# EasyEDA schematic 1-Schematic_LP2951-xx Matrix Test Board.json
TITLE: 12 Matrix LP2951 Evaluation Board; REV: 2.0; Date: 2024-05-15; Sheet: 1/1; Drawn By: daylenfeist; Company: STARR-Lab
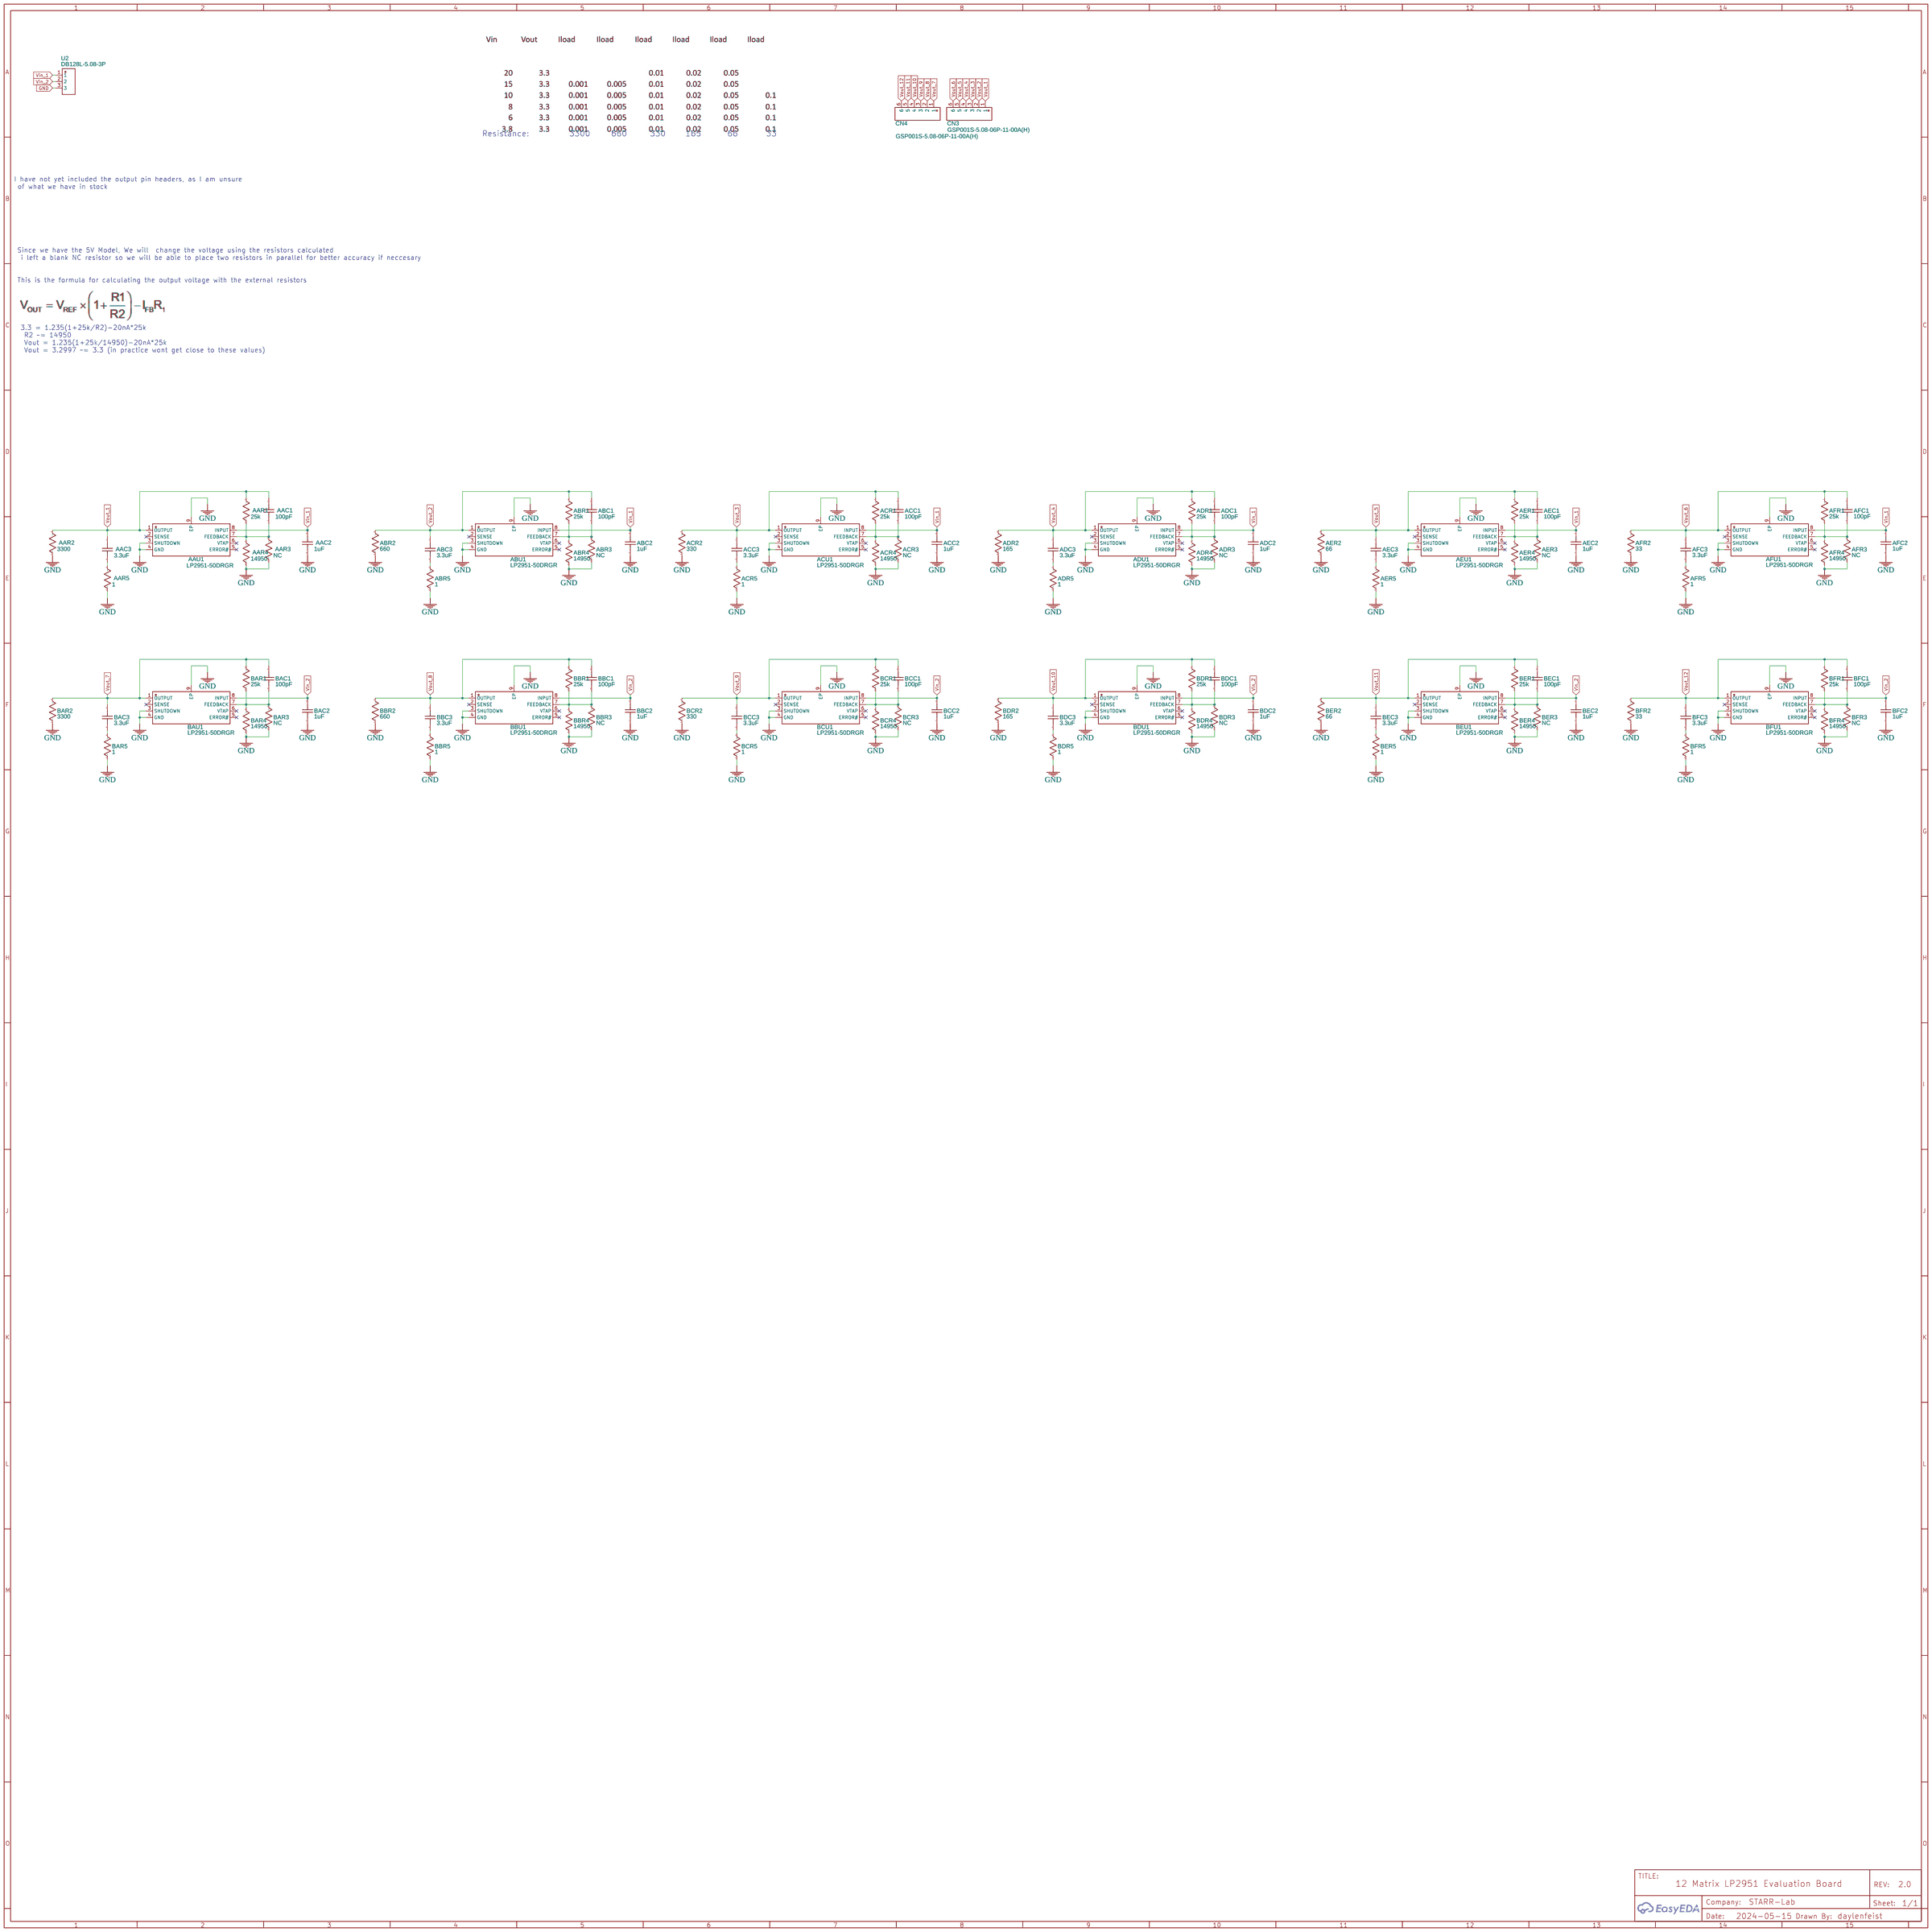
[diagram p0: schematic sheet]

## Parts
AAC1  100pF  [C0805]
AAC2  1uF  [C0805]
AAC3  3.3uF  [C0805]
AAR1  25k  [R0805]
AAR2  3300  [R0805]
AAR3  NC  [R0805]
AAR4  14950  [R0805]
AAR5  1  [R0805]
AAU1  LP2951-50DRGR  [WSON-8_L3.0-W3.0-P0.50-TL-EP]
ABC1  100pF  [C0805]
ABC2  1uF  [C0805]
ABC3  3.3uF  [C0805]
ABR1  25k  [R0805]
ABR2  660  [R0805]
ABR3  NC  [R0805]
ABR4  14950  [R0805]
ABR5  1  [R0805]
ABU1  LP2951-50DRGR  [WSON-8_L3.0-W3.0-P0.50-TL-EP]
ACC1  100pF  [C0805]
ACC2  1uF  [C0805]
ACC3  3.3uF  [C0805]
ACR1  25k  [R0805]
ACR2  330  [R0805]
ACR3  NC  [R0805]
ACR4  14950  [R0805]
ACR5  1  [R0805]
ACU1  LP2951-50DRGR  [WSON-8_L3.0-W3.0-P0.50-TL-EP]
ADC1  100pF  [C0805]
ADC2  1uF  [C0805]
ADC3  3.3uF  [C0805]
ADR1  25k  [R0805]
ADR2  165  [R0805]
ADR3  NC  [R0805]
ADR4  14950  [R0805]
ADR5  1  [R0805]
ADU1  LP2951-50DRGR  [WSON-8_L3.0-W3.0-P0.50-TL-EP]
AEC1  100pF  [C0805]
AEC2  1uF  [C0805]
AEC3  3.3uF  [C0805]
AER1  25k  [R0805]
AER2  66  [R0805]
AER3  NC  [R0805]
AER4  14950  [R0805]
AER5  1  [R0805]
AEU1  LP2951-50DRGR  [WSON-8_L3.0-W3.0-P0.50-TL-EP]
AFC1  100pF  [C0805]
AFC2  1uF  [C0805]
AFC3  3.3uF  [C0805]
AFR1  25k  [R0805]
AFR2  33  [R0805]
AFR3  NC  [R0805]
AFR4  14950  [R0805]
AFR5  1  [R0805]
AFU1  LP2951-50DRGR  [WSON-8_L3.0-W3.0-P0.50-TL-EP]
BAC1  100pF  [C0805]
BAC2  1uF  [C0805]
BAC3  3.3uF  [C0805]
BAR1  25k  [R0805]
BAR2  3300  [R0805]
BAR3  NC  [R0805]
BAR4  14950  [R0805]
BAR5  1  [R0805]
BAU1  LP2951-50DRGR  [WSON-8_L3.0-W3.0-P0.50-TL-EP]
BBC1  100pF  [C0805]
BBC2  1uF  [C0805]
BBC3  3.3uF  [C0805]
BBR1  25k  [R0805]
BBR2  660  [R0805]
BBR3  NC  [R0805]
BBR4  14950  [R0805]
BBR5  1  [R0805]
BBU1  LP2951-50DRGR  [WSON-8_L3.0-W3.0-P0.50-TL-EP]
BCC1  100pF  [C0805]
BCC2  1uF  [C0805]
BCC3  3.3uF  [C0805]
BCR1  25k  [R0805]
BCR2  330  [R0805]
BCR3  NC  [R0805]
BCR4  14950  [R0805]
BCR5  1  [R0805]
BCU1  LP2951-50DRGR  [WSON-8_L3.0-W3.0-P0.50-TL-EP]
BDC1  100pF  [C0805]
BDC2  1uF  [C0805]
BDC3  3.3uF  [C0805]
BDR1  25k  [R0805]
BDR2  165  [R0805]
BDR3  NC  [R0805]
BDR4  14950  [R0805]
BDR5  1  [R0805]
BDU1  LP2951-50DRGR  [WSON-8_L3.0-W3.0-P0.50-TL-EP]
BEC1  100pF  [C0805]
BEC2  1uF  [C0805]
BEC3  3.3uF  [C0805]
BER1  25k  [R0805]
BER2  66  [R0805]
BER3  NC  [R0805]
BER4  14950  [R0805]
BER5  1  [R0805]
BEU1  LP2951-50DRGR  [WSON-8_L3.0-W3.0-P0.50-TL-EP]
BFC1  100pF  [C0805]
BFC2  1uF  [C0805]
BFC3  3.3uF  [C0805]
BFR1  25k  [R0805]
BFR2  33  [R0805]
BFR3  NC  [R0805]
BFR4  14950  [R0805]
BFR5  1  [R0805]
BFU1  LP2951-50DRGR  [WSON-8_L3.0-W3.0-P0.50-TL-EP]
CN3  GSP001S-5.08-06P-11-00A(H)  [CONN-TH_6P-P5.08-GSP001S-5.08-06P]
CN4  GSP001S-5.08-06P-11-00A(H)  [CONN-TH_6P-P5.08-GSP001S-5.08-06P]
U2  DB128L-5.08-3P  [CONN-TH_DB128L-5.08-3P]

## Library data of the parts
AAC1-AAC3 ABC1-ABC3 ACC1-ACC3 ADC1-ADC3 AEC1-AEC3 AFC1-AFC3 BAC1-BAC3 BBC1-BBC3 BCC1-BCC3 BDC1-BDC3 BEC1-BEC3 BFC1-BFC3 = C_0603_US: Contributor: LCEDA_Lib
AAR1-AAR5 ABR1-ABR5 ACR1-ACR5 ADR1-ADR5 AER1-AER5 AFR1-AFR5 BAR1-BAR5 BBR1-BBR5 BCR1-BCR5 BDR1-BDR5 BER1-BER5 BFR1-BFR5 = R_0603_US: Contributor: LCEDA_Lib
AAU1 ABU1 ACU1 ADU1 AEU1 AFU1 BAU1 BBU1 BCU1 BDU1 BEU1 BFU1 = LP2951-50DRGR: Contributor: lcsc; Supplier: LCSC; Supplier Part: C2876162; Manufacturer: TI(德州仪器); JLCPCB Part Class: Extended Part
CN3 CN4 = GSP001S-5.08-06P-11-00A(H): Contributor: lcsc; Supplier: LCSC; Supplier Part: C5223759; Manufacturer: GOOSVN(高胜)
U2 = DB128L-5.08-3P: Contributor: LCSC; Supplier: LCSC; Supplier Part: C395869; Manufacturer: DORABO(地博电气); Manufacturer Part: DB128L-5.08-3P-GN-S; JLCPCB Part Class: Extended Part

## Nets
GND: AAC2.1 AAR2.1 AAR3.1 AAR4.1 AAR5.1 AAU1.3(SHUTDOWN) AAU1.4(GND) AAU1.9(EP) ABC2.1 ABR2.1 ABR3.1 ABR4.1 ABR5.1 ABU1.3(SHUTDOWN) ABU1.4(GND) ABU1.9(EP) ACC2.1 ACR2.1 ACR3.1 ACR4.1 ACR5.1 ACU1.3(SHUTDOWN) ACU1.4(GND) ACU1.9(EP) ADC2.1 ADR2.1 ADR3.1 ADR4.1 ADR5.1 ADU1.3(SHUTDOWN) ADU1.4(GND) ADU1.9(EP) AEC2.1 AER2.1 AER3.1 AER4.1 AER5.1 AEU1.3(SHUTDOWN) AEU1.4(GND) AEU1.9(EP) AFC2.1 AFR2.1 AFR3.1 AFR4.1 AFR5.1 AFU1.3(SHUTDOWN) AFU1.4(GND) AFU1.9(EP) BAC2.1 BAR2.1 BAR3.1 BAR4.1 BAR5.1 BAU1.3(SHUTDOWN) BAU1.4(GND) BAU1.9(EP) BBC2.1 BBR2.1 BBR3.1 BBR4.1 BBR5.1 BBU1.3(SHUTDOWN) BBU1.4(GND) BBU1.9(EP) BCC2.1 BCR2.1 BCR3.1 BCR4.1 BCR5.1 BCU1.3(SHUTDOWN) BCU1.4(GND) BCU1.9(EP) BDC2.1 BDR2.1 BDR3.1 BDR4.1 BDR5.1 BDU1.3(SHUTDOWN) BDU1.4(GND) BDU1.9(EP) BEC2.1 BER2.1 BER3.1 BER4.1 BER5.1 BEU1.3(SHUTDOWN) BEU1.4(GND) BEU1.9(EP) BFC2.1 BFR2.1 BFR3.1 BFR4.1 BFR5.1 BFU1.3(SHUTDOWN) BFU1.4(GND) BFU1.9(EP) U2.3
Vin_1: AAC2.2 AAU1.8(INPUT) ABC2.2 ABU1.8(INPUT) ACC2.2 ACU1.8(INPUT) ADC2.2 ADU1.8(INPUT) AEC2.2 AEU1.8(INPUT) AFC2.2 AFU1.8(INPUT) U2.1
Vin_2: BAC2.2 BAU1.8(INPUT) BBC2.2 BBU1.8(INPUT) BCC2.2 BCU1.8(INPUT) BDC2.2 BDU1.8(INPUT) BEC2.2 BEU1.8(INPUT) BFC2.2 BFU1.8(INPUT) U2.2
Vout_1: AAC1.1 AAC3.1 AAR1.2 AAR2.2 AAU1.1(OUTPUT) CN3.1
Vout_2: ABC1.1 ABC3.1 ABR1.2 ABR2.2 ABU1.1(OUTPUT) CN3.2
Vout_3: ACC1.1 ACC3.1 ACR1.2 ACR2.2 ACU1.1(OUTPUT) CN3.3
Vout_4: ADC1.1 ADC3.1 ADR1.2 ADR2.2 ADU1.1(OUTPUT) CN3.4
Vout_5: AEC1.1 AEC3.1 AER1.2 AER2.2 AEU1.1(OUTPUT) CN3.5
Vout_6: AFC1.1 AFC3.1 AFR1.2 AFR2.2 AFU1.1(OUTPUT) CN3.6
Vout_7: BAC1.1 BAC3.1 BAR1.2 BAR2.2 BAU1.1(OUTPUT) CN4.1
Vout_8: BBC1.1 BBC3.1 BBR1.2 BBR2.2 BBU1.1(OUTPUT) CN4.2
Vout_9: BCC1.1 BCC3.1 BCR1.2 BCR2.2 BCU1.1(OUTPUT) CN4.3
Vout_10: BDC1.1 BDC3.1 BDR1.2 BDR2.2 BDU1.1(OUTPUT) CN4.4
Vout_11: BEC1.1 BEC3.1 BER1.2 BER2.2 BEU1.1(OUTPUT) CN4.5
Vout_12: BFC1.1 BFC3.1 BFR1.2 BFR2.2 BFU1.1(OUTPUT) CN4.6
Net-(AAC1-2): AAC1.2 AAR1.1 AAR3.2 AAR4.2 AAU1.7(FEEDBACK)
Net-(AAC3-2): AAC3.2 AAR5.2
Net-(ABC1-2): ABC1.2 ABR1.1 ABR3.2 ABR4.2 ABU1.7(FEEDBACK)
Net-(ABC3-2): ABC3.2 ABR5.2
Net-(ACC1-2): ACC1.2 ACR1.1 ACR3.2 ACR4.2 ACU1.7(FEEDBACK)
Net-(ACC3-2): ACC3.2 ACR5.2
Net-(ADC1-2): ADC1.2 ADR1.1 ADR3.2 ADR4.2 ADU1.7(FEEDBACK)
Net-(ADC3-2): ADC3.2 ADR5.2
Net-(AEC1-2): AEC1.2 AER1.1 AER3.2 AER4.2 AEU1.7(FEEDBACK)
Net-(AEC3-2): AEC3.2 AER5.2
Net-(AFC1-2): AFC1.2 AFR1.1 AFR3.2 AFR4.2 AFU1.7(FEEDBACK)
Net-(AFC3-2): AFC3.2 AFR5.2
Net-(BAC1-2): BAC1.2 BAR1.1 BAR3.2 BAR4.2 BAU1.7(FEEDBACK)
Net-(BAC3-2): BAC3.2 BAR5.2
Net-(BBC1-2): BBC1.2 BBR1.1 BBR3.2 BBR4.2 BBU1.7(FEEDBACK)
Net-(BBC3-2): BBC3.2 BBR5.2
Net-(BCC1-2): BCC1.2 BCR1.1 BCR3.2 BCR4.2 BCU1.7(FEEDBACK)
Net-(BCC3-2): BCC3.2 BCR5.2
Net-(BDC1-2): BDC1.2 BDR1.1 BDR3.2 BDR4.2 BDU1.7(FEEDBACK)
Net-(BDC3-2): BDC3.2 BDR5.2
Net-(BEC1-2): BEC1.2 BER1.1 BER3.2 BER4.2 BEU1.7(FEEDBACK)
Net-(BEC3-2): BEC3.2 BER5.2
Net-(BFC1-2): BFC1.2 BFR1.1 BFR3.2 BFR4.2 BFU1.7(FEEDBACK)
Net-(BFC3-2): BFC3.2 BFR5.2

Not connected (* = marked no-connect by the designer): AAU1 2(SENSE)* 5(ERROR#)* 6(VTAP)*; ABU1 2(SENSE)* 5(ERROR#)* 6(VTAP)*; ACU1 2(SENSE)* 5(ERROR#)* 6(VTAP)*; ADU1 2(SENSE)* 5(ERROR#)* 6(VTAP)*; AEU1 2(SENSE)* 5(ERROR#)* 6(VTAP)*; AFU1 2(SENSE)* 5(ERROR#)* 6(VTAP)*; BAU1 2(SENSE)* 5(ERROR#)* 6(VTAP)*; BBU1 2(SENSE)* 5(ERROR#)* 6(VTAP)*; BCU1 2(SENSE)* 5(ERROR#)* 6(VTAP)*; BDU1 2(SENSE)* 5(ERROR#)* 6(VTAP)*; BEU1 2(SENSE)* 5(ERROR#)* 6(VTAP)*; BFU1 2(SENSE)* 5(ERROR#)* 6(VTAP)*

## Notes on the sheet
- Resistance:
- 3300
- 660
- 330
- 165
- 66
- 33
- I have not yet included the output pin headers, as I am unsure
   of what we have in stock
- Since we have the 5V Model, We will  change the voltage using the resistors calculated
   i left a blank NC resistor so we will be able to place two resistors in parallel for better accuracy if neccesary
  This is the formula for calculating the output voltage with the external resistors
- 3.3 = 1.235(1+25k/R2)-20nA*25k
   R2 ~= 14950
   Vout = 1.235(1+25k/14950)-20nA*25k
   Vout = 3.2997 ~= 3.3 (in practice wont get close to these values)
